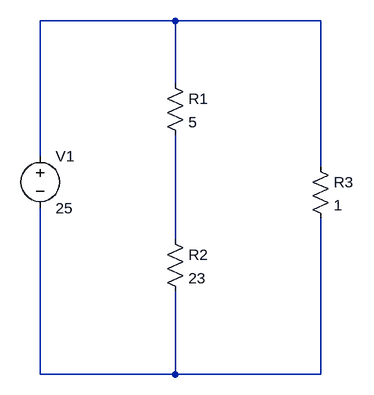
[diagram p0: schematic 2series1parallel.asc]
2series1parallel.asc, the LTspice schematic file:
Version 4
SHEET 1 880 680
WIRE 320 -64 112 -64
WIRE 544 -64 320 -64
WIRE 320 32 320 -64
WIRE 112 144 112 -64
WIRE 544 160 544 -64
WIRE 320 272 320 112
WIRE 112 480 112 224
WIRE 320 480 320 352
WIRE 320 480 112 480
WIRE 544 480 544 240
WIRE 544 480 320 480
SYMBOL voltage 112 128 R0
WINDOW 123 0 0 Left 0
WINDOW 39 0 0 Left 0
SYMATTR InstName V1
SYMATTR Value 25
SYMBOL res 304 16 R0
SYMATTR InstName R1
SYMATTR Value 5
SYMBOL res 304 256 R0
SYMATTR InstName R2
SYMATTR Value 23
SYMBOL res 528 144 R0
SYMATTR InstName R3
SYMATTR Value 1

The netlist it stands for:
* 2series1parallel.asc
V1 N001 N003 25
R1 N001 N002 5
R2 N002 N003 23
R3 N001 N003 1
.backanno
.end